# Altium schematic sheet DRV8301.SchDoc: DRV8301
size A4; DrawnBy: Caner ALP; DocumentNumber: 2; SheetNumber: 2; SheetTotal: 4
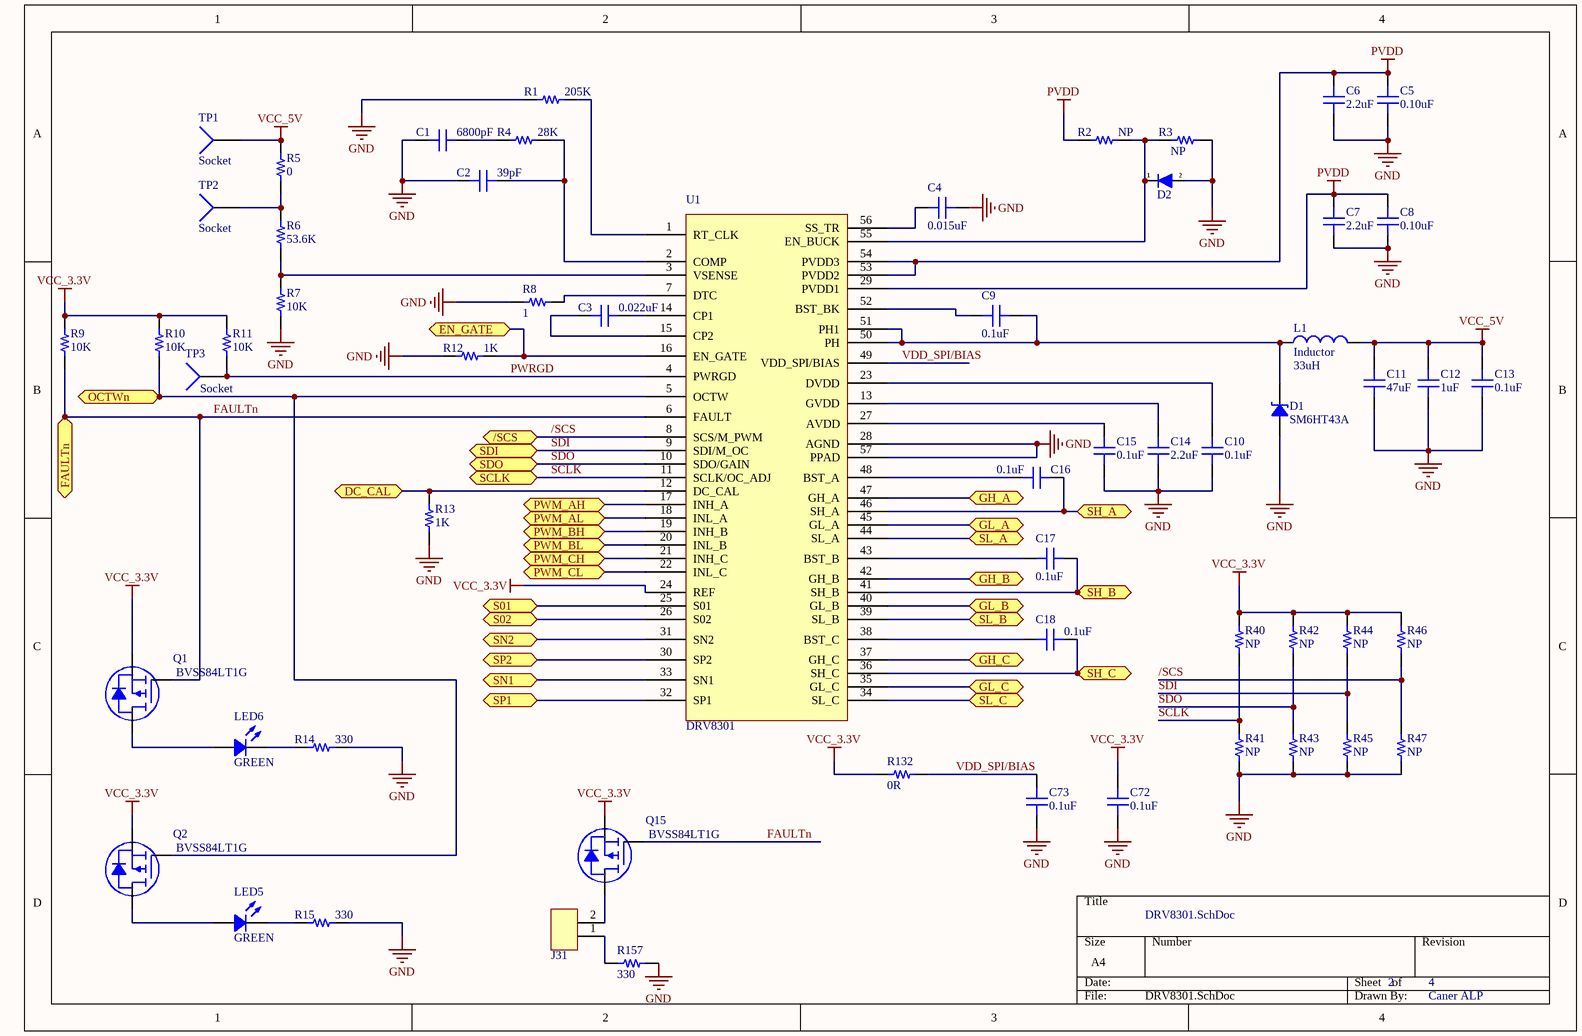
[diagram p0: DRV8301.SchDoc]

## Parts
C1  6800pF  [CAP 0603/1608]
C2  39pF  [CAP 0603/1608]
C3  0.022uF  [CAP 0603/1608]
C4  0.015uF  [CAP 0603/1608]
C5  0.10uF  [CAP 0805/2012]
C6  2.2uF  [CAP 1210/3225 - 2.5MM]
C7  2.2uF  [CAP 1210/3225 - 2.5MM]
C8  0.10uF  [CAP 0805/2012]
C9  0.1uF  [CAP 0603/1608]
C10  0.1uF  [CAP 0603/1608]
C11  47uF  [CAP 1210/3225 - 2.5MM]
C12  1uF  [CAP 0603/1608]
C13  0.1uF  [CAP 0603/1608]
C14  2.2uF  [CAP 0805/2012]
C15  0.1uF  [CAP 0603/1608]
C16  0.1uF  [CAP 0603/1608]
C17  0.1uF  [CAP 0603/1608]
C18  0.1uF  [CAP 0603/1608]
C72  0.1uF  [CAP 0603/1608]
C73  0.1uF  [CAP 0603/1608]
D1  SM6HT43A  [ST DO214AA SMB]
D2  1N5819  [SOD-123]  (value not drawn)
J31  HDR_1x2  [PINHEAD_2.54mm_1x2]  (value not drawn)
L1  Inductor  value 33uH  [9x9mm SMD Coil]
LED5  GREEN  [LED 0805/2012 YELLOW]
LED6  GREEN  [LED 0805/2012 YELLOW]
Q1  BVSS84LT1G  [ON SEMI SOT-23-3]
Q2  BVSS84LT1G  [ON SEMI SOT-23-3]
Q15  BVSS84LT1G  [ON SEMI SOT-23-3]
R1  205K  [RES 0603/1608]
R2  NP  [RES 0603/1608]
R3  NP  [RES 0603/1608]
R4  28K  [RES 0603/1608]
R5  0  [RES 0603/1608]
R6  53.6K  [RES 0603/1608]
R7  10K  [RES 0603/1608]
R8  1  [RES 0603/1608]
R9  10K  [RES 0603/1608]
R10  10K  [RES 0603/1608]
R11  10K  [RES 0603/1608]
R12  1K  [RES 0603/1608]
R13  1K  [RES 0603/1608]
R14  330  [RES 0603/1608]
R15  330  [RES 0603/1608]
R40  NP  [RES 0603/1608]
R41  NP  [RES 0603/1608]
R42  NP  [RES 0603/1608]
R43  NP  [RES 0603/1608]
R44  NP  [RES 0603/1608]
R45  NP  [RES 0603/1608]
R46  NP  [RES 0603/1608]
R47  NP  [RES 0603/1608]
R132  0R  [RES 0603/1608]
R157  330  [RES 0603/1608]
TP1  Socket  [PIN1]
TP2  Socket  [PIN1]
TP3  Socket  [PIN1]
U1  DRV8301  [HTSSOP56]

## Ports
/SCS, DC_CAL, EN_GATE, FAULTn, GH_A, GH_B, GH_C, GL_A, GL_B, GL_C, OCTWn, PWM_AH, PWM_AL, PWM_BH, PWM_BL, PWM_CH, PWM_CL, S01, S02, SCLK, SDI, SDO, SH_A, SH_B, SH_C, SL_A, SL_B, SL_C, SN1, SN2, SP1, SP2

## Nets
GND: C1.2 C2.2 C4.2 C5.1 C6.1 C7.1 C8.1 C10.1 C11.1 C12.1 C13.1 C14.1 C15.1 C72.1 C73.1 D1.1 D2.2 R1.2 R3.1 R7.1 R8.2 R12.1 R13.1 R14.2 R15.2 R41.2 R43.2 R45.2 R47.2 R157.1 U1.28(AGND) U1.57(PPAD)
PVDD: C5.2 C6.2 C7.2 C8.2 R2.2 U1.29(PVDD1) U1.53(PVDD2) U1.54(PVDD3)
VCC_3.3V: C72.2 Q1.3(S) Q2.3(S) Q15.3(S) R9.1 R10.1 R11.1 R40.1 R42.1 R44.1 R46.1 R132.1 U1.24(REF)
VCC_5V: C11.2 C12.2 C13.2 L1.2 R5.2 TP1.1
/SCS: R46.2 R47.1 U1.8(SCS/M_PWM) ; port /SCS
DC_CAL: R13.2 U1.12(DC_CAL) ; port DC_CAL
EN_GATE: R12.2 U1.16(EN_GATE) ; port EN_GATE
FAULTn: Q1.1(G) Q15.1(G) R9.2 U1.6(FAULT) ; port FAULTn
GH_A: U1.47(GH_A) ; port GH_A
GH_B: U1.42(GH_B) ; port GH_B
GH_C: U1.37(GH_C) ; port GH_C
GL_A: U1.45(GL_A) ; port GL_A
GL_B: U1.40(GL_B) ; port GL_B
GL_C: U1.35(GL_C) ; port GL_C
OCTWn: Q2.1(G) R10.2 U1.5(OCTW) ; port OCTWn
PWM_AH: U1.17(INH_A) ; port PWM_AH
PWM_AL: U1.18(INL_A) ; port PWM_AL
PWM_BH: U1.19(INH_B) ; port PWM_BH
PWM_BL: U1.20(INL_B) ; port PWM_BL
PWM_CH: U1.21(INH_C) ; port PWM_CH
PWM_CL: U1.22(INL_C) ; port PWM_CL
PWRGD: R11.2 TP3.1 U1.4(PWRGD)
S01: U1.25(S01) ; port S01
S02: U1.26(S02) ; port S02
SCLK: R40.2 R41.1 U1.11(SCLK/OC_ADJ) ; port SCLK
SDI: R44.2 R45.1 U1.9(SDI/M_OC) ; port SDI
SDO: R42.2 R43.1 U1.10(SDO/GAIN) ; port SDO
SH_A: C16.1 U1.46(SH_A) ; port SH_A
SH_B: C17.1 U1.41(SH_B) ; port SH_B
SH_C: C18.1 U1.36(SH_C) ; port SH_C
SL_A: U1.44(SL_A) ; port SL_A
SL_B: U1.39(SL_B) ; port SL_B
SL_C: U1.34(SL_C) ; port SL_C
SN1: U1.33(SN1) ; port SN1
SN2: U1.31(SN2) ; port SN2
SP1: U1.32(SP1) ; port SP1
SP2: U1.30(SP2) ; port SP2
VDD_SPI/BIAS: C73.2 R132.2 U1.49(VDD_SPI/BIAS)
NetC1_1: C1.1 R4.2
NetC2_1: C2.1 R4.1 U1.2(COMP)
NetC3_1: C3.1 U1.14(CP1)
NetC3_2: C3.2 U1.15(CP2)
NetC4_1: C4.1 U1.56(SS_TR)
NetC9_1: C9.1 U1.52(BST_BK)
NetC9_2: C9.2 D1.2 L1.1 U1.50(PH) U1.51(PH1)
NetC10_2: C10.2 U1.23(DVDD)
NetC14_2: C14.2 U1.13(GVDD)
NetC15_2: C15.2 U1.27(AVDD)
NetC16_2: C16.2 U1.48(BST_A)
NetC17_2: C17.2 U1.43(BST_B)
NetC18_2: C18.2 U1.38(BST_C)
NetD2_1: D2.1 R2.1 R3.2 U1.55(EN_BUCK)
NetJ31_1: J31.1 R157.2
NetJ31_2: J31.2 Q15.2(D)
NetLED5_1: LED5.1 Q2.2(D)
NetLED5_2: LED5.2 R15.1
NetLED6_1: LED6.1 Q1.2(D)
NetLED6_2: LED6.2 R14.1
NetR1_1: R1.1 U1.1(RT_CLK)
NetR5_1: R5.1 R6.2 TP2.1
NetR6_1: R6.1 R7.2 U1.3(VSENSE)
NetR8_1: R8.1 U1.7(DTC)

## Library data of the parts
C1-C4 C9 C10 C12 C13 C15-C18 C72 C73 = CC0603KPX7R7BB104: CAP CER 0.1UF 16V X7R 0603; Manufacturer: Yageo; TemperatureRange: -55C ~ 125C; Tolerance: 10%; Value: 0.1uF; Part Number: CC0603KPX7R7BB104; PartId: 5262; Supplier 1: Digi-Key; Supplier Part Number 1: 311-1335-2-ND; ComponentLink1Description: Datasheet; ComponentLink1URL: http://www.yageo.com/documents/recent/UPY-GPHC_X7R_6.3V-to-50V-v12.pdf; ComponentLink2Description: Digi-Key listing; ComponentLink2URL: http://digikey.com/product-detail/en/CC0603KPX7R7BB104/311-1335-2-ND/2103073; TemperatureCoefficient: X7R; Voltage: 16V; Price: 0,0043; Type: -; Device Package: 0603 (1608 Metric)
C5 C8 = C0805C104K1RACTU: CAP CER 0.1UF 100V X7R 0805; Manufacturer: Kemet; TemperatureRange: -55C ~ 125C; Tolerance: 10%; Value: 0.10uF; Part Number: C0805C104K1RACTU; PartId: 13746; Supplier 1: Digi-Key; Supplier Part Number 1: 399-3486-2-ND; ComponentLink1Description: Datasheet; ComponentLink1URL: http://www.kemet.com/docfinder?Partnumber=C0805C104K1RACTU; ComponentLink2Description: Digi-Key Listing; ComponentLink2URL: https://www.digikey.com/product-detail/en/kemet/C0805C104K1RACTU/399-3486-2-ND/754748; TemperatureCoefficient: X7R; Voltage: 100V; Price: 0,0462; Device Package: 0805 (2012 Metric)
C6 C7 C11 = C3225X7R2A225K230AM: CAP CER 2.2UF 100V X7R 1210; Manufacturer: TDK Corporation; TemperatureRange: -55C ~ 125C; Tolerance: 10%; Value: 2.2uF; Part Number: C3225X7R2A225K230AM; PartId: 18956; Supplier 1: Digi-Key; Supplier Part Number 1: 445-6098-2-ND; ComponentLink1Description: Datasheet; ComponentLink1URL: https://product.tdk.com/info/en/catalog/datasheets/mlcc_commercial_openmode_en.pdf; ComponentLink2Description: Digi-Key Listing; ComponentLink2URL: https://www.digikey.com/product-detail/en/tdk-corporation/C3225X7R2A225K230AM/445-6098-2-ND/2443575; TemperatureCoefficient: X7R; Voltage: 100V; Price: 0,3129; Device Package: 1210 (3225 Metric)
C14 = C0805C104K1RACTU: CAP CER 0.1UF 100V X7R 0805; Manufacturer: Kemet; Value: 0.10uF; TemperatureRange: -55C ~ 125C; Tolerance: 10%; Part Number: C0805C104K1RACTU; PartId: 13746; Supplier 1: Digi-Key; Supplier Part Number 1: 399-3486-2-ND; ComponentLink1Description: Datasheet; ComponentLink1URL: http://www.kemet.com/docfinder?Partnumber=C0805C104K1RACTU; ComponentLink2Description: Digi-Key Listing; ComponentLink2URL: https://www.digikey.com/product-detail/en/kemet/C0805C104K1RACTU/399-3486-2-ND/754748; TemperatureCoefficient: X7R; Voltage: 100V; Price: 0,0462; Device Package: 0805 (2012 Metric)
D1 = SM6HT43A: TVS DIODE 36.8VWM 59.3VC SMB; Manufacturer: STMicroelectronics; Type: Zener; Unidirectional Channels: 1; Power - Peak Pulse: 600W; Current - Peak Pulse: 10.1A; Voltage (Clamping): 59.3V; Voltage (Breakdown): 40.9V; Voltage (Reverse Standoff): 36.8V; Part Number: SM6HT43A; PartId: 14657; Supplier 1: Digi-Key; Supplier Part Number 1: 497-7425-2-ND; ComponentLink1Description: Datasheet; ComponentLink1URL: http://www.st.com/web/en/resource/technical/document/datasheet/CD00001782.pdf; ComponentLink2Description: Digi-Key Listing; ComponentLink2URL: https://www.digikey.com/product-detail/en/stmicroelectronics/SM6HT43A/497-7425-2-ND/1039067; Operating Temperature: -65C ~ 175C (TJ); Price: 0,2755; Device Package: DO-214AA, SMB
D2 = DIO00002: DIODE SCHOTTKY 40V 1A SOD123; Manufacturer Part Number: 1N5819HW-7-F; Manufacturer: Diodes Incorporated; Check Footprint: AB; Part Number: DIO00002; Check Symbol: AB; HelpURL: http://www.diodes.com/_files/datasheets/ds30217.pdf; Supplier 1: Digi-Key; Supplier Part Number 1: 1N5819HW-FDICT-ND; Voltage - DC Reverse (Max): 40V; Current: 1A; Reverse Recovery Time (trr): -; Type: Schottky; Operating Temperature: -65°C ~ 125°C
J31 = J00093: CONN HEADER 2POS .100 VERT TIN; Part Number: J00093; Manufacturer: Molex, LLC; Manufacturer Part Number: 22284020; Connector Type: Header, Unshrouded, Breakaway; Pitch: 2.54mm; Number of Positions: 2; Current Rating: 4A; Voltage - Rated: 250V; Series: KK® 42375; Supplier 1: Digi-Key; Contact Type: Male Pin; Mounting Type: Through Hole; Supplier Part Number 1: WM50014-02-ND; HelpURL: http://www.molex.com/pdm_docs/sd/022284020_sd.pdf; Operating Temperature: -40°C ~ 105°C; Contact Finish: Tin; Housing Color: Black; Number of Rows: 1
L1 = Inductor: Code_IEC: 1005; Published: 8-Jun-2000; LatestRevisionDate: 29-May-2009; LatestRevisionNote: IPC-7351 Footprint Added.; PackageReference: 0402-A; Publisher: Altium Limited; PackageDescription: Chip Inductor; Code_JEITA: 0402
LED5 LED6 = LTST-C170KFKT: LED ORANGE CLEAR 0805 SMD; Manufacturer: Lite-On Inc.; Type: Surface Mount; Millicandela: 90mcd; Voltage Forward: 2V; Current (Test): 20mA; Viewing Angle: 130; Value: Green; Part Number: LTST-C170KFKT; PartId: 7079; Supplier 1: Digi-Key; Supplier Part Number 1: 160-1413-2-ND; ComponentLink1Description: Datasheet; ComponentLink1URL: http://optoelectronics.liteon.com/upload/download/DS-22-99-0185/S_110_LTST-C170KFKT.pdf; ComponentLink2Description: Digi-Key Listing; ComponentLink2URL: http://www.digikey.ca/product-detail/en/LTST-C170KFKT/160-1413-2-ND/386775; Price: 0,0638; Device Package: 0805 (2012 Metric); Colour: Orange; Lens Transparency: Clear
Q1 Q2 Q15 = BVSS84LT1G: MOSFET P-CH 50V 130MA SOT-23-3; Manufacturer: ON Semiconductor; Type: MOSFET P-Channel, Metal Oxide; Rds On (Max) at Id, Vgs: 10 Ohm @ 100mA, 5V; Vgs(th) (Max) at Id: 2V @ 250uA; Gate Charge (Qg): 2.2nC @ 10V; Input Capacitance (Ciss) at Vds: 36pF @ 5V; Power - Max: 225mW; Current Continuous Drain: 130mA (Ta); Part Number: BVSS84LT1G; PartId: 8198; Supplier 1: Digi-Key; Supplier Part Number 1: BVSS84LT1GOSTR-ND; ComponentLink1Description: Datasheet; ComponentLink1URL: http://www.onsemi.com/pub_link/Collateral/BSS84LT1-D.PDF; ComponentLink2Description: Digi-Key Listing; ComponentLink2URL: http://www.digikey.com/product-detail/en/BVSS84LT1G/BVSS84LT1GOSTR-ND/3062044; Price: 0,0674; Device Package: TO-236-3, SC-59, SOT-23-3; Drain to Source Voltage (Vdss): 50V; Features: Standard
R1-R13 R40-R47 R132 = ERJ-3GEYJ331V: RES SMD 330 OHM 5% 1/10W 0603; Manufacturer: Panasonic Electronic Components; Value: 330; TemperatureRange: -55C ~ 155C; TemperatureCoefficient: 200ppm/C; PowerRating: 0.1W, 1/10W; Part Number: ERJ-3GEYJ331V; PartId: 11189; Supplier 1: Digi-Key; Supplier Part Number 1: P330GTR-ND; ComponentLink1Description: Datasheet; ComponentLink1URL: http://industrial.panasonic.com/www-cgi/jvcr13pz.cgi?E+PZ+3+AOA0001+ERJ3GEYJ331V+7+WW; ComponentLink2Description: Digi-Key Listing; ComponentLink2URL: https://www.digikey.com/product-detail/en/panasonic-electronic-components/ERJ-3GEYJ331V/P330GTR-ND/135755; Tolerance: 5%; Price: 0,002; Device Package: 0603 (1608 Metric)
R14 R15 R157 = ERJ-3GEYJ331V: RES SMD 330 OHM 5% 1/10W 0603; Manufacturer: Panasonic Electronic Components; TemperatureRange: -55C ~ 155C; TemperatureCoefficient: 200ppm/C; PowerRating: 0.1W, 1/10W; Value: 330; Part Number: ERJ-3GEYJ331V; PartId: 11189; Supplier 1: Digi-Key; Supplier Part Number 1: P330GTR-ND; ComponentLink1Description: Datasheet; ComponentLink1URL: http://industrial.panasonic.com/www-cgi/jvcr13pz.cgi?E+PZ+3+AOA0001+ERJ3GEYJ331V+7+WW; ComponentLink2Description: Digi-Key Listing; ComponentLink2URL: https://www.digikey.com/product-detail/en/panasonic-electronic-components/ERJ-3GEYJ331V/P330GTR-ND/135755; Tolerance: 5%; Price: 0,002; Device Package: 0603 (1608 Metric)
U1 = DRV83xx
TP1-TP3 = Socket: LatestRevisionDate: 17-Jul-2002; LatestRevisionNote: Re-released for DXP Platform.; Publisher: Altium Limited